# Altium project PokerFace.PrjPcb
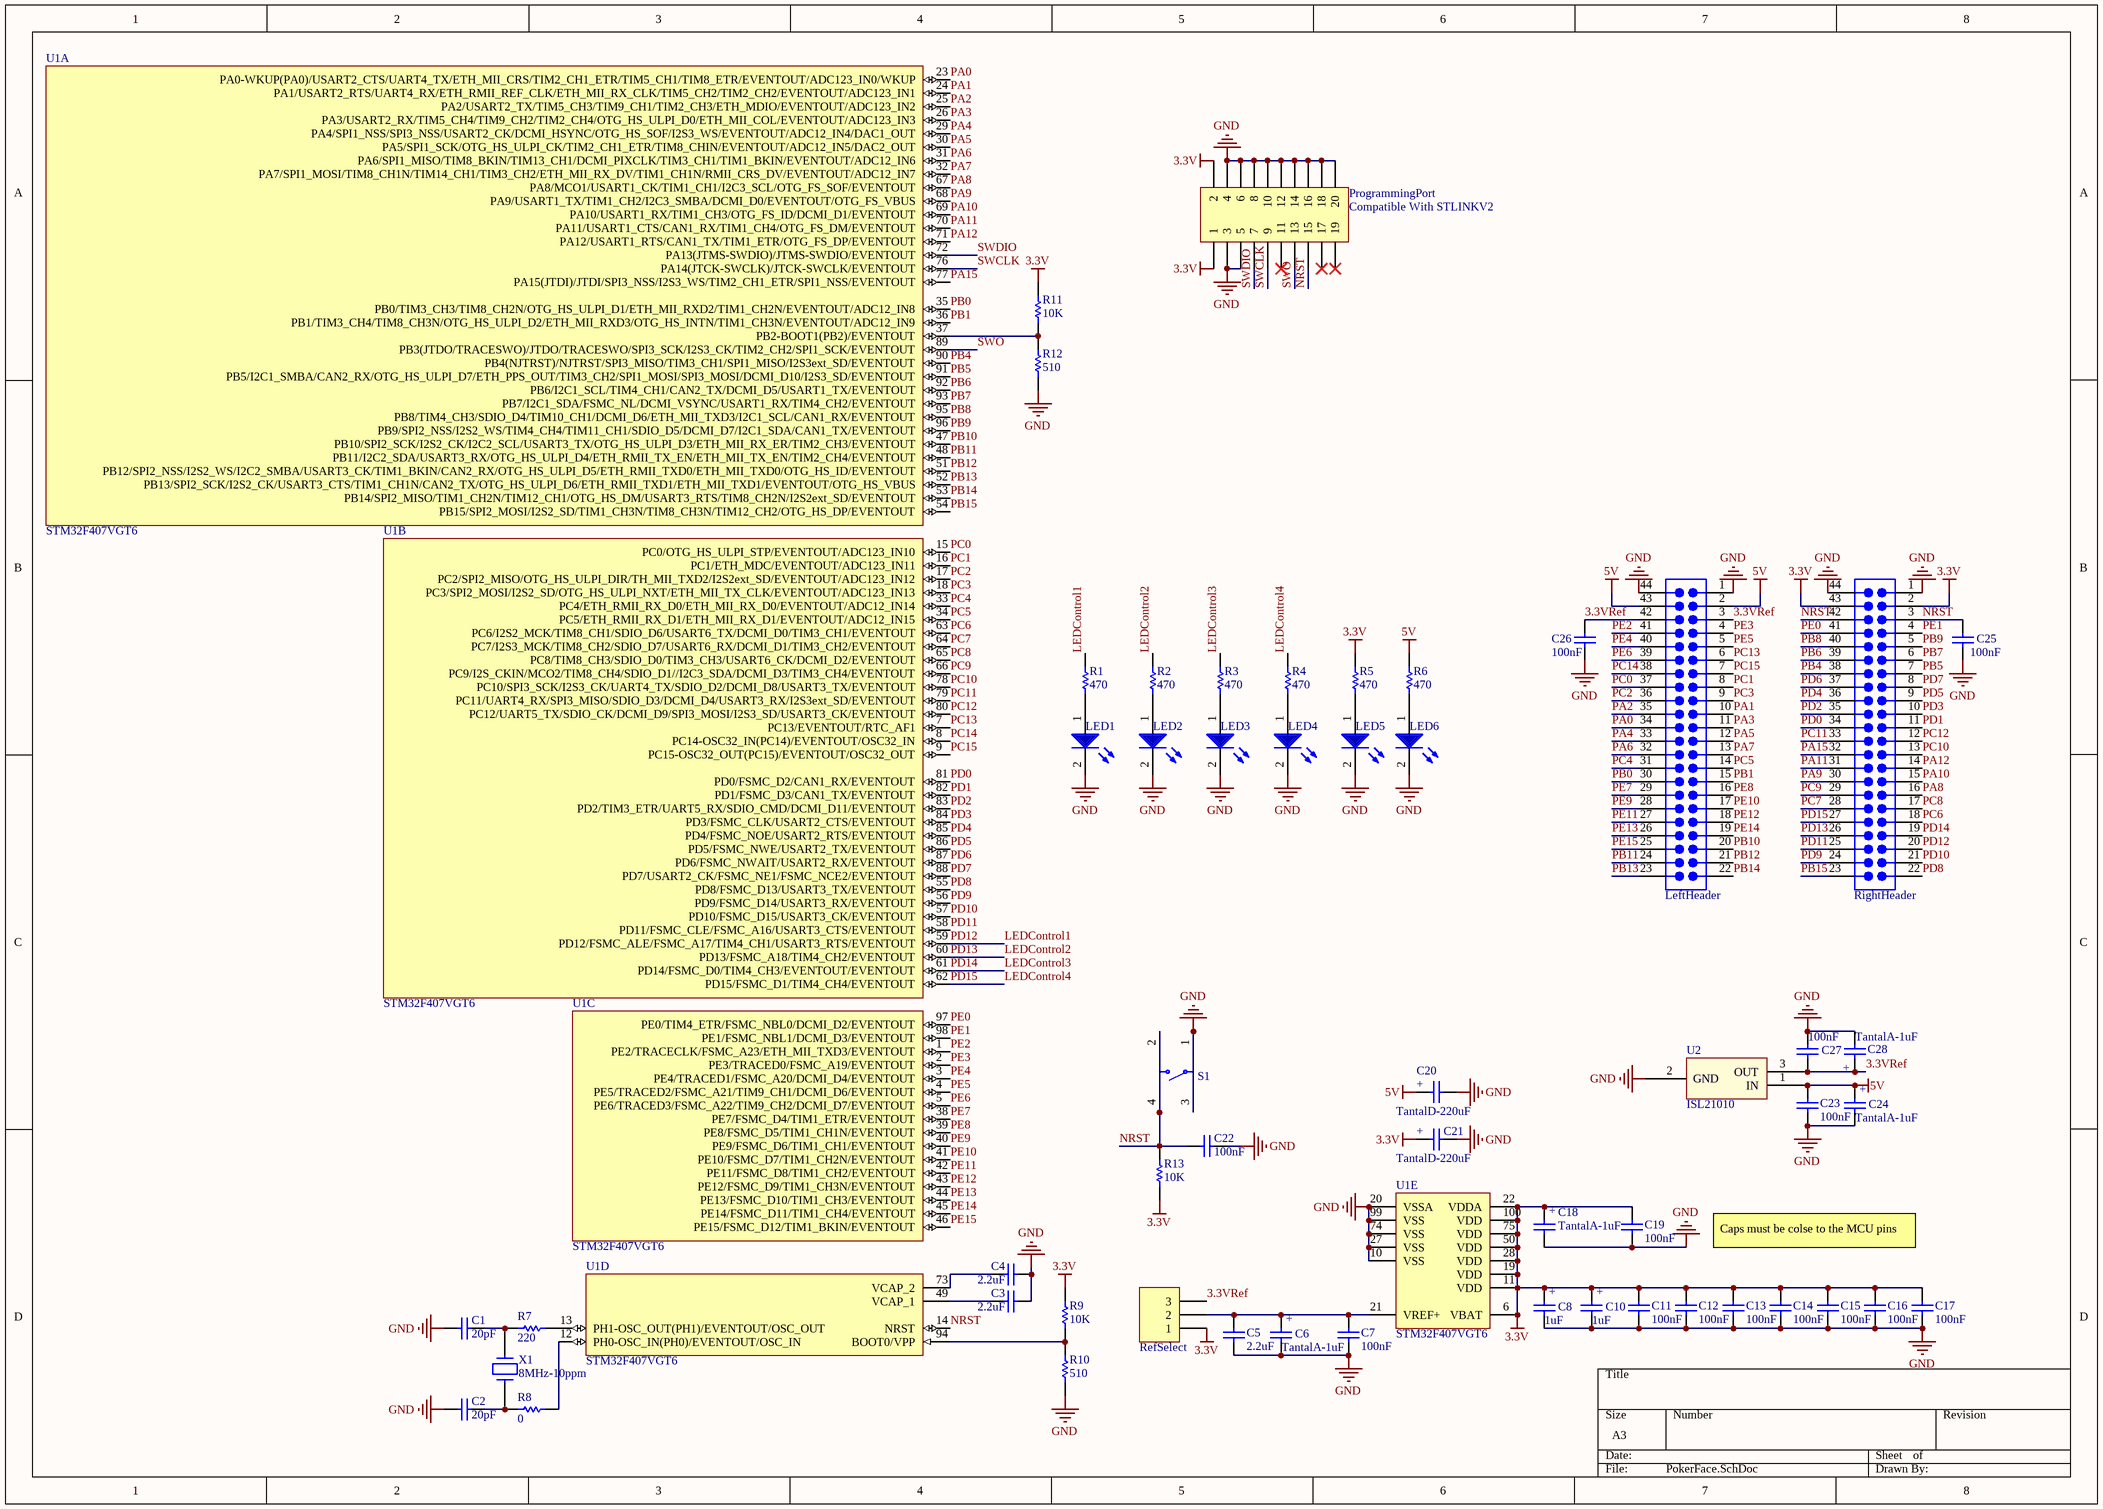
[diagram p0: PokerFace.SchDoc]
1 sheet, 54 parts. Net scope: global (net labels, ports and power ports of the same name join across sheets).
Board file: PokerFace.PcbDoc

## Sheet PokerFace.SchDoc
size A3

### Parts
C1  20pF  [SMD 805 CAP]
C2  20pF  [SMD 805 CAP]
C3  2.2uF  [SMD 805 CAP]
C4  2.2uF  [SMD 805 CAP]
C5  2.2uF  [SMD 805 CAP]
C6  TantalA-1uF  [MY_CAP_SMD-A]
C7  100nF  [SMD 805 CAP]
C8  1uF  [MY_CAP_SMD-A]
C10  1uF  [MY_CAP_SMD-A]
C11  100nF  [SMD 805 CAP]
C12  100nF  [SMD 805 CAP]
C13  100nF  [SMD 805 CAP]
C14  100nF  [SMD 805 CAP]
C15  100nF  [SMD 805 CAP]
C16  100nF  [SMD 805 CAP]
C17  100nF  [SMD 805 CAP]
C18  TantalA-1uF  [MY_CAP_SMD-A]
C19  100nF  [SMD 805 CAP]
C20  TantalD-220uF  [MY_CAP_SMD-D]
C21  TantalD-220uF  [MY_CAP_SMD-D]
C22  100nF  [SMD 805 CAP]
C23  100nF  [SMD 805 CAP]
C24  TantalA-1uF  [MY_CAP_SMD-A]
C25  100nF  [SMD 805 CAP]
C26  100nF  [SMD 805 CAP]
C27  100nF  [SMD 805 CAP]
C28  TantalA-1uF  [MY_CAP_SMD-A]
LED1  150080BS75000  [LED_0805_Blue]  (value not drawn)
LED2  150080BS75000  [LED_0805_Blue]  (value not drawn)
LED3  150080BS75000  [LED_0805_Blue]  (value not drawn)
LED4  150080BS75000  [LED_0805_Blue]  (value not drawn)
LED5  150080BS75000  [LED_0805_Blue]  (value not drawn)
LED6  150080BS75000  [LED_0805_Blue]  (value not drawn)
LeftHeader  WE-2.54 mm Pin Header & Jumper 61304421121  [61304421121]  (value not drawn)
ProgrammingPort  Compatible With STLINKV2  [61202021621]
R1  470  [SMD 805]
R2  470  [SMD 805]
R3  470  [SMD 805]
R4  470  [SMD 805]
R5  470  [SMD 805]
R6  470  [SMD 805]
R7  220  [SMD 805]
R8  0  [SMD 805]
R9  10K  [SMD 805]
R10  510  [SMD 805]
R11  10K  [SMD 805]
R12  510  [SMD 805]
R13  10K  [SMD 805]
RefSelect  WE-2.54 mm Pin Header & Jumper 61300311121  [61300311121]  (value not drawn)
RightHeader  WE-2.54 mm Pin Header & Jumper 61304421121  [61304421121]  (value not drawn)
S1  6*6 TactSwitch  [4301x20508x6]  (value not drawn)
U1  STM32F407VGT6  [LQFP100_V]  (parts A,B,C,D,E of 5)
U2  ISL21010  [SOT-23]
X1  8MHz-10ppm  [My_Crystal]

### Nets
3.3V: C8.+ C10.+ C11.1 C12.1 C13.1 C14.1 C15.1 C16.1 C17.1 C18.+ C19.1 C21.+ ProgrammingPort.1 ProgrammingPort.2 R5.2 R9.2 R11.2 R13.1 RefSelect.1 RightHeader.2 RightHeader.43 U1.6(VBAT) U1.11(VDD) U1.19(VDD) U1.22(VDDA) U1.28(VDD) U1.50(VDD) U1.75(VDD) U1.100(VDD)
5V: C20.+ C23.1 C24.+ LeftHeader.2 LeftHeader.43 R6.2 U2.1(IN)
GND: C1.2 C2.2 C3.1 C4.1 C5.2 C6.- C7.2 C8.- C10.- C11.2 C12.2 C13.2 C14.2 C15.2 C16.2 C17.2 C18.- C19.2 C20.- C21.- C22.1 C23.2 C24.- C25.2 C26.2 C27.1 C28.- LED1.2(C) LED2.2(C) LED3.2(C) LED4.2(C) LED5.2(C) LED6.2(C) LeftHeader.1 LeftHeader.44 ProgrammingPort.3 ProgrammingPort.4 ProgrammingPort.5 ProgrammingPort.6 ProgrammingPort.8 ProgrammingPort.10 ProgrammingPort.12 ProgrammingPort.14 ProgrammingPort.16 ProgrammingPort.18 ProgrammingPort.20 R10.1 R12.1 RightHeader.1 RightHeader.44 S1.1 S1.3 U1.10(VSS) U1.20(VSSA) U1.27(VSS) U1.74(VSS) U1.99(VSS) U2.2(GND)
3.3VRef: C26.1 C27.2 C28.+ LeftHeader.3 LeftHeader.42 RefSelect.3 U2.3(OUT)
LEDControl1: R1.2 RightHeader.20 U1.59(PD12/FSMC_ALE/FSMC_A17/TIM4_CH1/USART3_RTS/EVENTOUT)  [also labelled PD12]
LEDControl2: R2.2 RightHeader.26 U1.60(PD13/FSMC_A18/TIM4_CH2/EVENTOUT)  [also labelled PD13]
LEDControl3: R3.2 RightHeader.19 U1.61(PD14/FSMC_D0/TIM4_CH3/EVENTOUT/EVENTOUT)  [also labelled PD14]
LEDControl4: R4.2 RightHeader.27 U1.62(PD15/FSMC_D1/TIM4_CH4/EVENTOUT)  [also labelled PD15]
NRST: C22.2 C25.1 ProgrammingPort.15 R13.2 RightHeader.3 RightHeader.42 S1.2 S1.4 U1.14(NRST)
PA0: LeftHeader.34 U1.23(PA0-WKUP(PA0)/USART2_CTS/UART4_TX/ETH_MII_CRS/TIM2_CH1_ETR/TIM5_CH1/TIM8_ETR/EVENTOUT/ADC123_IN0/WKUP)
PA1: LeftHeader.10 U1.24(PA1/USART2_RTS/UART4_RX/ETH_RMII_REF_CLK/ETH_MII_RX_CLK/TIM5_CH2/TIM2_CH2/EVENTOUT/ADC123_IN1)
PA2: LeftHeader.35 U1.25(PA2/USART2_TX/TIM5_CH3/TIM9_CH1/TIM2_CH3/ETH_MDIO/EVENTOUT/ADC123_IN2)
PA3: LeftHeader.11 U1.26(PA3/USART2_RX/TIM5_CH4/TIM9_CH2/TIM2_CH4/OTG_HS_ULPI_D0/ETH_MII_COL/EVENTOUT/ADC123_IN3)
PA4: LeftHeader.33 U1.29(PA4/SPI1_NSS/SPI3_NSS/USART2_CK/DCMI_HSYNC/OTG_HS_SOF/I2S3_WS/EVENTOUT/ADC12_IN4/DAC1_OUT)
PA5: LeftHeader.12 U1.30(PA5/SPI1_SCK/OTG_HS_ULPI_CK/TIM2_CH1_ETR/TIM8_CHIN/EVENTOUT/ADC12_IN5/DAC2_OUT)
PA6: LeftHeader.32 U1.31(PA6/SPI1_MISO/TIM8_BKIN/TIM13_CH1/DCMI_PIXCLK/TIM3_CH1/TIM1_BKIN/EVENTOUT/ADC12_IN6)
PA7: LeftHeader.13 U1.32(PA7/SPI1_MOSI/TIM8_CH1N/TIM14_CH1/TIM3_CH2/ETH_MII_RX_DV/TIM1_CH1N/RMII_CRS_DV/EVENTOUT/ADC12_IN7)
PA8: RightHeader.16 U1.67(PA8/MCO1/USART1_CK/TIM1_CH1/I2C3_SCL/OTG_FS_SOF/EVENTOUT)
PA9: RightHeader.30 U1.68(PA9/USART1_TX/TIM1_CH2/I2C3_SMBA/DCMI_D0/EVENTOUT/OTG_FS_VBUS)
PA10: RightHeader.15 U1.69(PA10/USART1_RX/TIM1_CH3/OTG_FS_ID/DCMI_D1/EVENTOUT)
PA11: RightHeader.31 U1.70(PA11/USART1_CTS/CAN1_RX/TIM1_CH4/OTG_FS_DM/EVENTOUT)
PA12: RightHeader.14 U1.71(PA12/USART1_RTS/CAN1_TX/TIM1_ETR/OTG_FS_DP/EVENTOUT)
PA15: RightHeader.32 U1.77(PA15(JTDI)/JTDI/SPI3_NSS/I2S3_WS/TIM2_CH1_ETR/SPI1_NSS/EVENTOUT)
PB0: LeftHeader.30 U1.35(PB0/TIM3_CH3/TIM8_CH2N/OTG_HS_ULPI_D1/ETH_MII_RXD2/TIM1_CH2N/EVENTOUT/ADC12_IN8)
PB1: LeftHeader.15 U1.36(PB1/TIM3_CH4/TIM8_CH3N/OTG_HS_ULPI_D2/ETH_MII_RXD3/OTG_HS_INTN/TIM1_CH3N/EVENTOUT/ADC12_IN9)
PB4: RightHeader.38 U1.90(PB4(NJTRST)/NJTRST/SPI3_MISO/TIM3_CH1/SPI1_MISO/I2S3ext_SD/EVENTOUT)
PB5: RightHeader.7 U1.91(PB5/I2C1_SMBA/CAN2_RX/OTG_HS_ULPI_D7/ETH_PPS_OUT/TIM3_CH2/SPI1_MOSI/SPI3_MOSI/DCMI_D10/I2S3_SD/EVENTOUT)
PB6: RightHeader.39 U1.92(PB6/I2C1_SCL/TIM4_CH1/CAN2_TX/DCMI_D5/USART1_TX/EVENTOUT)
PB7: RightHeader.6 U1.93(PB7/I2C1_SDA/FSMC_NL/DCMI_VSYNC/USART1_RX/TIM4_CH2/EVENTOUT)
PB8: RightHeader.40 U1.95(PB8/TIM4_CH3/SDIO_D4/TIM10_CH1/DCMI_D6/ETH_MII_TXD3/I2C1_SCL/CAN1_RX/EVENTOUT)
PB9: RightHeader.5 U1.96(PB9/SPI2_NSS/I2S2_WS/TIM4_CH4/TIM11_CH1/SDIO_D5/DCMI_D7/I2C1_SDA/CAN1_TX/EVENTOUT)
PB10: LeftHeader.20 U1.47(PB10/SPI2_SCK/I2S2_CK/I2C2_SCL/USART3_TX/OTG_HS_ULPI_D3/ETH_MII_RX_ER/TIM2_CH3/EVENTOUT)
PB11: LeftHeader.24 U1.48(PB11/I2C2_SDA/USART3_RX/OTG_HS_ULPI_D4/ETH_RMII_TX_EN/ETH_MII_TX_EN/TIM2_CH4/EVENTOUT)
PB12: LeftHeader.21 U1.51(PB12/SPI2_NSS/I2S2_WS/I2C2_SMBA/USART3_CK/TIM1_BKIN/CAN2_RX/OTG_HS_ULPI_D5/ETH_RMII_TXD0/ETH_MII_TXD0/OTG_HS_ID/EVENTOUT)
PB13: LeftHeader.23 U1.52(PB13/SPI2_SCK/I2S2_CK/USART3_CTS/TIM1_CH1N/CAN2_TX/OTG_HS_ULPI_D6/ETH_RMII_TXD1/ETH_MII_TXD1/EVENTOUT/OTG_HS_VBUS)
PB14: LeftHeader.22 U1.53(PB14/SPI2_MISO/TIM1_CH2N/TIM12_CH1/OTG_HS_DM/USART3_RTS/TIM8_CH2N/I2S2ext_SD/EVENTOUT)
PB15: RightHeader.23 U1.54(PB15/SPI2_MOSI/I2S2_SD/TIM1_CH3N/TIM8_CH3N/TIM12_CH2/OTG_HS_DP/EVENTOUT)
PC0: LeftHeader.37 U1.15(PC0/OTG_HS_ULPI_STP/EVENTOUT/ADC123_IN10)
PC1: LeftHeader.8 U1.16(PC1/ETH_MDC/EVENTOUT/ADC123_IN11)
PC2: LeftHeader.36 U1.17(PC2/SPI2_MISO/OTG_HS_ULPI_DIR/TH_MII_TXD2/I2S2ext_SD/EVENTOUT/ADC123_IN12)
PC3: LeftHeader.9 U1.18(PC3/SPI2_MOSI/I2S2_SD/OTG_HS_ULPI_NXT/ETH_MII_TX_CLK/EVENTOUT/ADC123_IN13)
PC4: LeftHeader.31 U1.33(PC4/ETH_RMII_RX_D0/ETH_MII_RX_D0/EVENTOUT/ADC12_IN14)
PC5: LeftHeader.14 U1.34(PC5/ETH_RMII_RX_D1/ETH_MII_RX_D1/EVENTOUT/ADC12_IN15)
PC6: RightHeader.18 U1.63(PC6/I2S2_MCK/TIM8_CH1/SDIO_D6/USART6_TX/DCMI_D0/TIM3_CH1/EVENTOUT)
PC7: RightHeader.28 U1.64(PC7/I2S3_MCK/TIM8_CH2/SDIO_D7/USART6_RX/DCMI_D1/TIM3_CH2/EVENTOUT)
PC8: RightHeader.17 U1.65(PC8/TIM8_CH3/SDIO_D0/TIM3_CH3/USART6_CK/DCMI_D2/EVENTOUT)
PC9: RightHeader.29 U1.66(PC9/I2S_CKIN/MCO2/TIM8_CH4/SDIO_D1//I2C3_SDA/DCMI_D3/TIM3_CH4/EVENTOUT)
PC10: RightHeader.13 U1.78(PC10/SPI3_SCK/I2S3_CK/UART4_TX/SDIO_D2/DCMI_D8/USART3_TX/EVENTOUT)
PC11: RightHeader.33 U1.79(PC11/UART4_RX/SPI3_MISO/SDIO_D3/DCMI_D4/USART3_RX/I2S3ext_SD/EVENTOUT)
PC12: RightHeader.12 U1.80(PC12/UART5_TX/SDIO_CK/DCMI_D9/SPI3_MOSI/I2S3_SD/USART3_CK/EVENTOUT)
PC13: LeftHeader.6 U1.7(PC13/EVENTOUT/RTC_AF1)
PC14: LeftHeader.38 U1.8(PC14-OSC32_IN(PC14)/EVENTOUT/OSC32_IN)
PC15: LeftHeader.7 U1.9(PC15-OSC32_OUT(PC15)/EVENTOUT/OSC32_OUT)
PD0: RightHeader.34 U1.81(PD0/FSMC_D2/CAN1_RX/EVENTOUT)
PD1: RightHeader.11 U1.82(PD1/FSMC_D3/CAN1_TX/EVENTOUT)
PD2: RightHeader.35 U1.83(PD2/TIM3_ETR/UART5_RX/SDIO_CMD/DCMI_D11/EVENTOUT)
PD3: RightHeader.10 U1.84(PD3/FSMC_CLK/USART2_CTS/EVENTOUT)
PD4: RightHeader.36 U1.85(PD4/FSMC_NOE/USART2_RTS/EVENTOUT)
PD5: RightHeader.9 U1.86(PD5/FSMC_NWE/USART2_TX/EVENTOUT)
PD6: RightHeader.37 U1.87(PD6/FSMC_NWAIT/USART2_RX/EVENTOUT)
PD7: RightHeader.8 U1.88(PD7/USART2_CK/FSMC_NE1/FSMC_NCE2/EVENTOUT)
PD8: RightHeader.22 U1.55(PD8/FSMC_D13/USART3_TX/EVENTOUT)
PD9: RightHeader.24 U1.56(PD9/FSMC_D14/USART3_RX/EVENTOUT)
PD10: RightHeader.21 U1.57(PD10/FSMC_D15/USART3_CK/EVENTOUT)
PD11: RightHeader.25 U1.58(PD11/FSMC_CLE/FSMC_A16/USART3_CTS/EVENTOUT)
PE0: RightHeader.41 U1.97(PE0/TIM4_ETR/FSMC_NBL0/DCMI_D2/EVENTOUT)
PE1: RightHeader.4 U1.98(PE1/FSMC_NBL1/DCMI_D3/EVENTOUT)
PE2: LeftHeader.41 U1.1(PE2/TRACECLK/FSMC_A23/ETH_MII_TXD3/EVENTOUT)
PE3: LeftHeader.4 U1.2(PE3/TRACED0/FSMC_A19/EVENTOUT)
PE4: LeftHeader.40 U1.3(PE4/TRACED1/FSMC_A20/DCMI_D4/EVENTOUT)
PE5: LeftHeader.5 U1.4(PE5/TRACED2/FSMC_A21/TIM9_CH1/DCMI_D6/EVENTOUT)
PE6: LeftHeader.39 U1.5(PE6/TRACED3/FSMC_A22/TIM9_CH2/DCMI_D7/EVENTOUT)
PE7: LeftHeader.29 U1.38(PE7/FSMC_D4/TIM1_ETR/EVENTOUT)
PE8: LeftHeader.16 U1.39(PE8/FSMC_D5/TIM1_CH1N/EVENTOUT)
PE9: LeftHeader.28 U1.40(PE9/FSMC_D6/TIM1_CH1/EVENTOUT)
PE10: LeftHeader.17 U1.41(PE10/FSMC_D7/TIM1_CH2N/EVENTOUT)
PE11: LeftHeader.27 U1.42(PE11/FSMC_D8/TIM1_CH2/EVENTOUT)
PE12: LeftHeader.18 U1.43(PE12/FSMC_D9/TIM1_CH3N/EVENTOUT)
PE13: LeftHeader.26 U1.44(PE13/FSMC_D10/TIM1_CH3/EVENTOUT)
PE14: LeftHeader.19 U1.45(PE14/FSMC_D11/TIM1_CH4/EVENTOUT)
PE15: LeftHeader.25 U1.46(PE15/FSMC_D12/TIM1_BKIN/EVENTOUT)
SWCLK: ProgrammingPort.9 U1.76(PA14(JTCK-SWCLK)/JTCK-SWCLK/EVENTOUT)
SWDIO: ProgrammingPort.7 U1.72(PA13(JTMS-SWDIO)/JTMS-SWDIO/EVENTOUT)
SWO: ProgrammingPort.13 U1.89(PB3(JTDO/TRACESWO)/JTDO/TRACESWO/SPI3_SCK/I2S3_CK/TIM2_CH2/SPI1_SCK/EVENTOUT)
NetC1_1: C1.1 R7.1 X1.2
NetC2_1: C2.1 R8.1 X1.1
NetC3_2: C3.2 U1.49(VCAP_1)
NetC4_2: C4.2 U1.73(VCAP_2)
NetC5_1: C5.1 C6.+ C7.1 RefSelect.2 U1.21(VREF+)
NetLED1_1: LED1.1(A) R1.1
NetLED2_1: LED2.1(A) R2.1
NetLED3_1: LED3.1(A) R3.1
NetLED4_1: LED4.1(A) R4.1
NetLED5_1: LED5.1(A) R5.1
NetLED6_1: LED6.1(A) R6.1
NetR7_2: R7.2 U1.13(PH1-OSC_OUT(PH1)/EVENTOUT/OSC_OUT)
NetR8_2: R8.2 U1.12(PH0-OSC_IN(PH0)/EVENTOUT/OSC_IN)
NetR9_1: R9.1 R10.2 U1.94(BOOT0/VPP)
NetR11_1: R11.1 R12.2 U1.37(PB2-BOOT1(PB2)/EVENTOUT)

Not connected (* = marked no-connect by the designer): ProgrammingPort 11* 17* 19*

### Notes on the sheet
- Caps must be colse to the MCU pins

### Library data of the parts
C1-C5 C7 C11-C17 C19 C22 C23 C25-C27 = CAP without Pole
C6 C8 C10 C18 C24 C28 = CAP_TANTAL_A: 3.2X1.6MM; Value: 3300u
C20 C21 = CAP_TANTAL_D: 7.3X4.3MM; Value: 3300u
LED1-LED6 = WL-SMCW 0805  150080BS75000: SMD mono-color Chip LED, WL-SMCW, Blue; Manufacturer: W黵th Elektronik eiSos GmbH; PartNo: 150080BS75000; ComponentLink1Description: Manufacturer; ComponentLink1URL: http://www.we-online.de; Created by: Christin Otto; Created Date: June 2013; ComponentLink2Description: Datasheet; ComponentLink2URL: http://katalog.we-online.com/led/datasheet/150080BS75000.pdf; Color: Blue
LeftHeader RightHeader = WE-2.54 mm Pin Header & Jumper 61304421121: WR-PHD 2.54 mm Dual Pin Header; Manufacturer: W¨¹rth Elektronik eiSos GmbH; ComponentLink1 Description: Manufacturer; ComponentLink2 Description: Datasheet; NoPins: 44; Created Date: 25 March 2013; partNo: 61304421121; ComponentLink1URL: http://www.we-online.com; ComponentLink2URL: http://katalog.we-online.de/em/datasheet/6130xx21121.pdf; Created by: Karrer Zheng
ProgrammingPort = WE-2,54mm_Box Header 61202021621: WR-BHD 2.54mm Male Box Header; Manufacturer: W¨¹rth Elektronik eiSos GmbH; ComponentLink1 Description: Manufacturer; ComponentLink2 Description: Datasheet; NoPins: 20; Created Date: 6 May 2013; partNo: 61202021621; ComponentLink1URL: http://www.we-online.com; ComponentLink2URL: http://katalog.we-online.de/em/datasheet/6120xx21621.pdf; Created by: Karrer Zheng
R1-R13 = Resistor
RefSelect = WE-2.54 mm Pin Header & Jumper 61300311121: WR-PHD 2.54mm Pin Header; Manufacturer: W¨¹rth Elektronik eiSos GmbH; ComponentLink1 Description: Manufacturer; ComponentLink2 Description: Datasheet; NoPins: 03; Created Date: 22 March 2013; partNo: 61300311121; ComponentLink1URL: http://www.we-online.com; ComponentLink2URL: http://katalog.we-online.de/em/datasheet/6130xx11121.pdf; Created by: Karrer Zheng
S1 = WS-TASV, 430152050836: WS-TASV 6x6 mm SMD; Manufacturer: Wurth Elektronik; partNo: 430152050836; ComponentLink1Description: Manufacturer; ComponentLink1URL: http://www.we-online.de; Created by: Baojun Chen; Created Date: Dec.2015; ComponentLink2Description: Datasheet; ComponentLink2URL: http://katalog.we-online.de/em/datasheet/4301x2xxx8x6.pdf
U1 = STM32F407VGT6: ARM Cortex-M4 32b MCU+FPU, 210DMIP, 1024 kB Flash, 192+4 kB RAM, Camera, 82 I/Os, 100-pin LQFP, -40 to +85°C, Tray; Internal RAM: 192kB; Operating Frequency (Processor Speed): 168MHz; A/D Converter: 16x12-bit; D/A Converter: 2x12-bit; 16-bit Timers (IC/OC/PWM): 12x16-bit(24/24/30); 32-bit Timer (IC/OC/PWM): 2x32-bit (8/8/8); Other Timer Functions: 2xWDG, RTC, 24-bit down counter; Serial Interface: 3xSPI/2xI2S/2xI2C/3xUSART(IrDa, ISO7816)/3xUART/2xUSB OTG FS/HS, 2xCAN/Ethernet MAC10/100, SDIO; DatasheetVersion: rev2, Jan-2012; PackageVersion: 2012; PackageReference: LQFP100; PackageDescription: 100-Pin Low Profile Quad Flat Package, 14x14 mm Body, 0.5 mm Pitch; ComponentLink1Description: Manufacturer URL; ComponentLink1URL: http://www.st.com/; ComponentLink2Description: STM32F405/7 Datasheet; ComponentLink2URL: http://www.st.com/internet/com/TECHNICAL_RESOURCES/TECHNICAL_LITERATURE/DATASHEET/DM00037051.pdf; ComponentLink3Description: STM32F4 Web Page; ComponentLink3URL: http://www.st.com/internet/mcu/subclass/1521.jsp
X1 = CRYSTAL